# Altium schematic sheet P1.schdoc
size 309 x 223 mm; Symbol: Sheet-Symbol_A5; Device: Sheet-Symbol_A5; @Page Name: P1; @Create Date: 2023-09-04; @Page Count: 1; @Page No: 1; @Project Name: USB2.0 Hub（未验证）; @Schematic Name: Schematic1; @Update Date: 2023-09-15; Company: 深圳嘉立创科技发展有限公司; Drawed: Camellia-ya; Page Size: A5; Part Number: JLCPCB-001; Reviewed: Camellia-ya; Version: V0.1
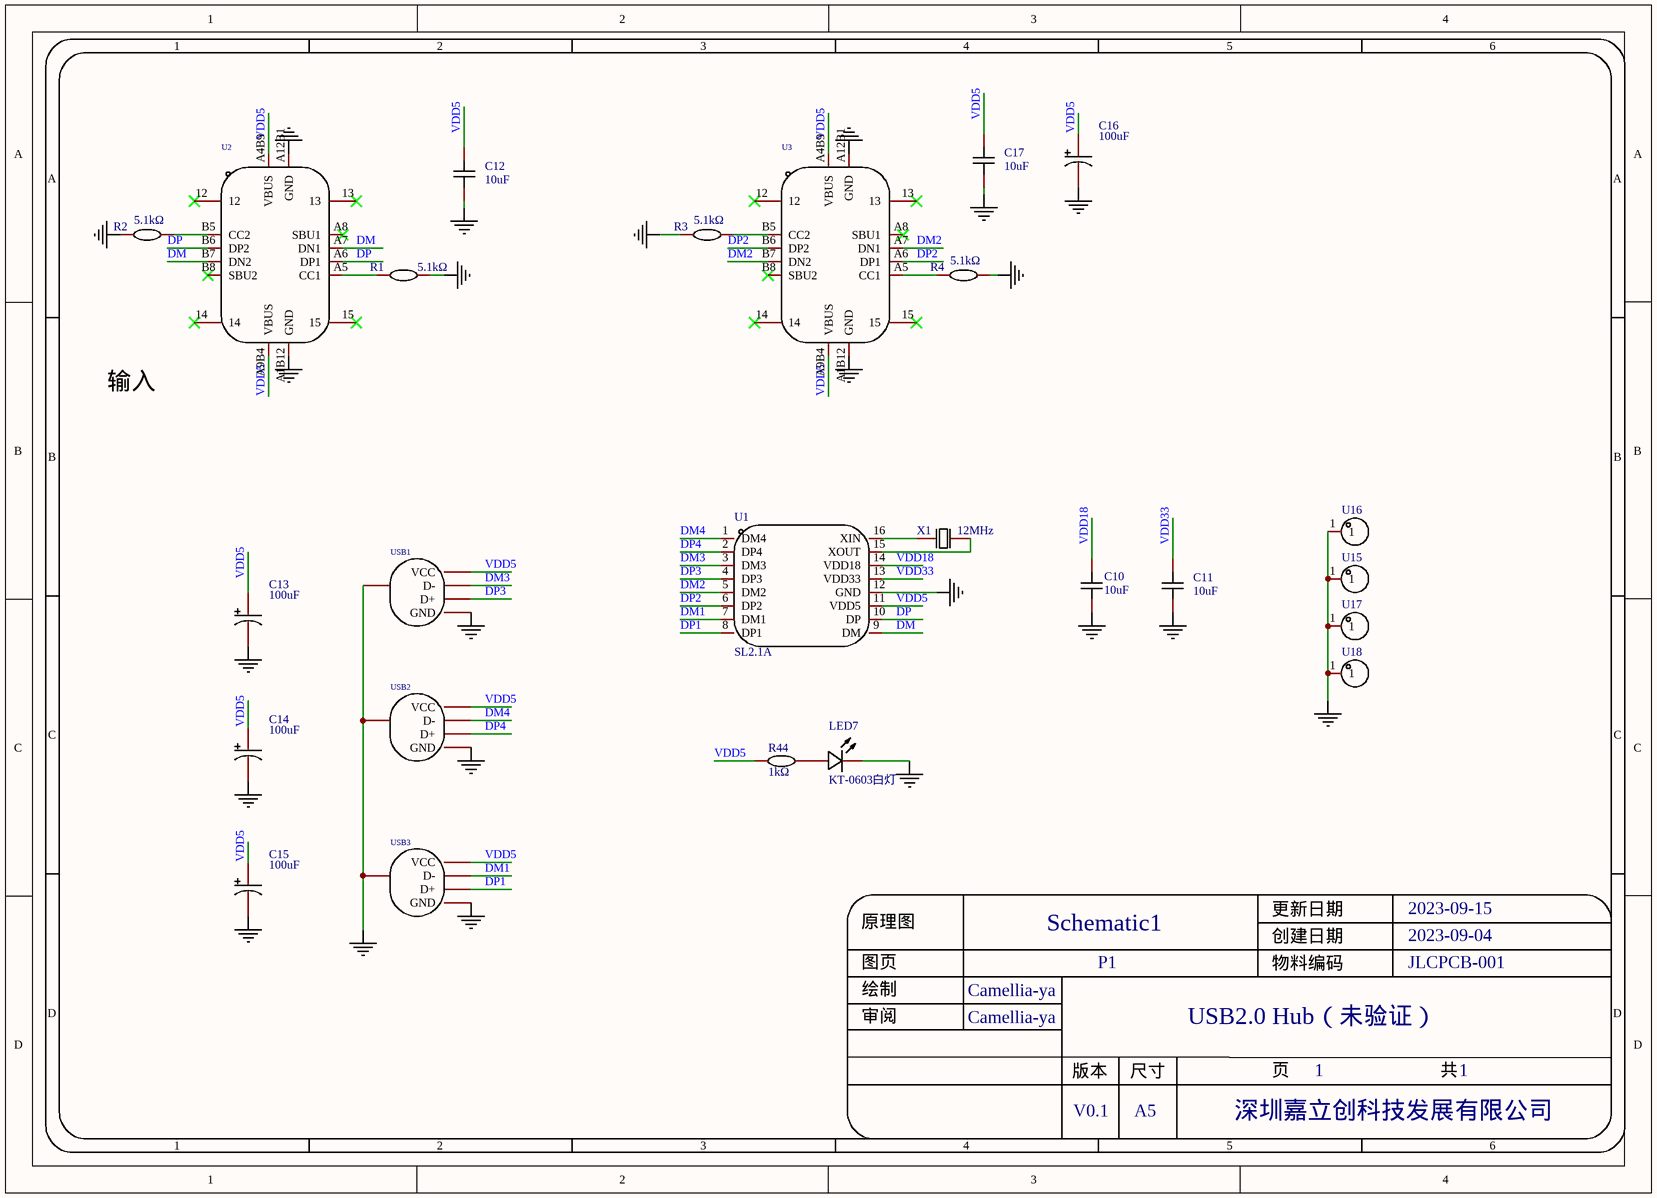
[diagram p0: P1.schdoc]

## Parts
C10  10uF  [C0603]
C11  10uF  [C0603]
C12  10uF  [C0603]
C13  100uF  [CAP-SMD_BD8.0-L8.3-W8.3-LS9.0-FD]
C14  100uF  [CAP-SMD_BD8.0-L8.3-W8.3-LS9.0-FD]
C15  100uF  [CAP-SMD_BD8.0-L8.3-W8.3-LS9.0-FD]
C16  100uF  [CAP-SMD_BD8.0-L8.3-W8.3-LS9.0-FD]
C17  10uF  [C0603]
LED7  KT-0603白灯  [LED0603-R-RD_WHITE]
R1  5.1kΩ  [R0603]
R2  5.1kΩ  [R0603]
R3  5.1kΩ  [R0603]
R4  5.1kΩ  [R0603]
R44  1kΩ  [R0603]
U1  SL2.1A  [SOP-16_L10.0-W3.9-P1.27-LS6.0-BL]
U2  YTC-TC16-273A1  [TYPE-C-SMD_YIYUAN_YTC-TC16-273A1]  (value not drawn)
U3  YTC-TC16-273A1  [TYPE-C-SMD_YIYUAN_YTC-TC16-273A1]  (value not drawn)
U15  铜柱M3*12+3  [TH_BD4.7-D3.0]  (value not drawn)
U16  铜柱M3*12+3  [TH_BD4.7-D3.0]  (value not drawn)
U17  铜柱M3*12+3  [TH_BD4.7-D3.0]  (value not drawn)
U18  铜柱M3*12+3  [TH_BD4.7-D3.0]  (value not drawn)
USB1  AF 90° WJDG  [USB-A-TH_AF-WJDG]  (value not drawn)
USB2  AF 90° WJDG  [USB-A-TH_AF-WJDG]  (value not drawn)
USB3  AF 90° WJDG  [USB-A-TH_AF-WJDG]  (value not drawn)
X1  12MHz  [HC-49US_L11.5-W4.5-P4.88]

## Nets
NetC10_1: C10.1 C11.2 C12.2 C13.2 C14.2 C15.2 C16.2 C17.2 LED7.2(K) R1.1 R2.2 R3.2 R4.1 U1.12(GND) U2.A1B12(GND) U2.A12B1(GND) U3.A1B12(GND) U3.A12B1(GND) U15.1 U16.1 U17.1 U18.1 USB1.4(GND) USB1.5(SHLD) USB2.4(GND) USB2.5(SHLD) USB3.4(GND) USB3.5(SHLD)
DM: U1.9(DM) U2.A7(DN1) U2.B7(DN2)
DM1: U1.7(DM1) USB3.2(D-)
DM2: U1.5(DM2) U3.A7(DN1) U3.B7(DN2)
DM3: U1.3(DM3) USB1.2(D-)
DM4: U1.1(DM4) USB2.2(D-)
DP: U1.10(DP) U2.A6(DP1) U2.B6(DP2)
DP1: U1.8(DP1) USB3.3(D+)
DP2: U1.6(DP2) U3.A6(DP1) U3.B6(DP2)
DP3: U1.4(DP3) USB1.3(D+)
DP4: U1.2(DP4) USB2.3(D+)
VDD5: C12.1 C13.1 C14.1 C15.1 C16.1 C17.1 R44.2 U1.11(VDD5) U2.A4B9(VBUS) U2.A9B4(VBUS) U3.A4B9(VBUS) U3.A9B4(VBUS) USB1.1(VCC) USB2.1(VCC) USB3.1(VCC)
VDD18: C10.2 U1.14(VDD18)
VDD33: C11.1 U1.13(VDD33)
NetLED7_1: LED7.1(A) R44.1
NetR1_2: R1.2 U2.A5(CC1)
NetR2_1: R2.1 U2.B5(CC2)
NetR3_1: R3.1 U3.B5(CC2)
NetR4_2: R4.2 U3.A5(CC1)
NetU1_15: U1.15(XOUT) X1.2(OSC2)
NetU1_16: U1.16(XIN) X1.1(OSC1)

Not connected (* = marked no-connect by the designer): U2 12* 13* 14* 15* A8(SBU1)* B8(SBU2)*; U3 12* 13* 14* 15* A8(SBU1)* B8(SBU2)*

## Notes on the sheet
- 输入
- 1
- 2
- 3
- 4
- 5
- 6
- A
- B
- C
- 原理图
- Schematic1
- 创建日期
- 更新日期
- 2023-09-04
- 2023-09-15
- D
- 审阅
- 绘制
- 图页
- Camellia-ya
- P1
- 物料编码
- USB2.0 Hub（未验证）
- JLCPCB-001
- 版本
- 尺寸
- 页
- 共
- V0.1
- A5
- 深圳嘉立创科技发展有限公司

## Library data of the parts
C10-C12 C17 = CL10A106MA8NRNC: 容值:10uF;精度:±20%;额定电压:25V;材质(温度系数):X5R;; Manufacturer: SAMSUNG(三星); Add into BOM: yes; Tolerance: ±20%; Voltage Rated: 25V; Temperature Coefficient: X5R; Name: 10uF; Symbol: CL10A106MA8NRNC; Device: CL10A106MA8NRNC; LCSC Part Name: 10uF ±20% 25V; Supplier Part: C96446; Manufacturer Part: CL10A106MA8NRNC; Supplier Footprint: 0603; JLCPCB Part Class: 基础库; Datasheet: https://atta.szlcsc.com/upload/public/pdf/source/20170325/1490427913016.pdf; Supplier: LCSC; Convert to PCB: yes; Value: 10uF
C13-C16 = VZH101M1ETR-0806: 容值:100uF;精度:±20%;额定电压:25V;纹波电流:-;等效串联电阻:-;; Manufacturer: lelon(立隆); Symbol: VZH101M1E0806-TRO; Add into BOM: yes; Tolerance: ±20%; Rated Voltage: 25V; φD: 8mm; L: 6.5mm; Lifetime @ Temp: 5000hrs@105℃; Name: 100uF; Device: VZH101M1ETR-0806; LCSC Part Name: 100uF ±20% 25V; Supplier Part: C249834; Manufacturer Part: VZH101M1ETR-0806; Supplier Footprint: SMD,D8xL6.5mm; JLCPCB Part Class: 扩展库; Datasheet: https://atta.szlcsc.com/upload/public/pdf/source/20181114/C249834_B81E92EBF737ED9019D9F6C5277923E5.pdf; Supplier: LCSC; Convert to PCB: yes; Value: 100uF; Ripple Current: -; Equivalent Series Resistance(ESR): -; Operating Temperature: -45℃~+105℃
LED7 = KT-0603白灯: 发光颜色:白灯;; Manufacturer: KENTO; Symbol: 0603White light_C2290; Add into BOM: yes; Emitted Color: 白灯; Name: KT-0603白灯; Device: KT-0603白灯; LCSC Part Name: 白灯; Supplier Part: C2290; Manufacturer Part: KT-0603白灯; Supplier Footprint: 0603; JLCPCB Part Class: 基础库; Datasheet: https://atta.szlcsc.com/upload/public/pdf/source/20221101/4C23D5C85BA051E44A00B833D0A41468.pdf; Supplier: LCSC; Convert to PCB: yes
R1-R4 = 0603WAF5101T5E: 电阻类型:厚膜电阻;阻值:5.1kΩ;精度:±1%;功率:100mW;温度系数:±100ppm/℃;最大工作电压:75V;工作温度范围:-55℃~+155℃;; Manufacturer: UNI-ROYAL(厚声); Add into BOM: yes; Tolerance: ±1%; Power(Watts): 100mW; Overload Voltage (Max): 75V; Name: 5.1kΩ; Symbol: 0603WAF5101T5E; Device: 0603WAF5101T5E; LCSC Part Name: 5.1kΩ ±1% 100mW; Supplier Part: C23186; Manufacturer Part: 0603WAF5101T5E; Supplier Footprint: 0603; JLCPCB Part Class: 基础库; Datasheet: https://atta.szlcsc.com/upload/public/pdf/source/20200306/C422600_1E6D84923E4A46A82E41ADD87F860B5C.pdf; Supplier: LCSC; Convert to PCB: yes; Type: 厚膜电阻; Value: 5.1kΩ; Temperature Coefficient: ±100ppm/℃; Operating Temperature Range: -55℃~+155℃
R44 = 0603WAF1001T5E: 电阻类型:厚膜电阻;阻值:1kΩ;精度:±1%;功率:100mW;; Manufacturer: UNI-ROYAL(厚声); Add into BOM: yes; Tolerance: ±1%; Power(Watts): 100mW; Temperature Coefficient: ±100ppm/℃; Overload Voltage (Max): 75V; Name: 1kΩ; Symbol: 0603WAF1001T5E; Device: 0603WAF1001T5E; LCSC Part Name: 1kΩ ±1% 100mW; Supplier Part: C21190; Manufacturer Part: 0603WAF1001T5E; Supplier Footprint: 0603; JLCPCB Part Class: 基础库; Datasheet: https://atta.szlcsc.com/upload/public/pdf/source/20200306/C422600_1E6D84923E4A46A82E41ADD87F860B5C.pdf; Supplier: LCSC; Convert to PCB: yes; Type: 厚膜电阻; Value: 1kΩ; Operating Temperature Range: -55℃~+155℃
U1 = SL2.1A: 应用功能:集线器;接口协议:-;; Manufacturer: CoreChips(和芯润德); Add into BOM: yes; Applications Function: 集线器; Name: SL2.1A; Symbol: SL2.1A; Device: SL2.1A; LCSC Part Name: SL2.1A USB2.0 HUB 控制器集成电路; Supplier Part: C192893; Manufacturer Part: SL2.1A; Supplier Footprint: SOP-16; JLCPCB Part Class: 扩展库; Datasheet: https://atta.szlcsc.com/upload/public/pdf/source/20180522/C192893_624110D24898D57AAC785E3DF98EA862.pdf; Supplier: LCSC; Convert to PCB: yes; Protocol: -
U2 U3 = YTC-TC16-273A1: 连接器类型:Type-C;公母:母座;触点数量:16;; Manufacturer: YIYUAN(怡远); Add into BOM: yes; Connector Type: Type-C; Gender: 母座; Number of Contacts: 16; NUMBER: A12B1; Name: YTC-TC16-273A1; Symbol: YTC-TC16-273A1; Device: YTC-TC16-273A1; LCSC Part Name: Type-C 母座 16 板上 SMT L=7.3 全贴; Supplier Part: C5260486; Manufacturer Part: YTC-TC16-273A1; Supplier Footprint: SMD; JLCPCB Part Class: 扩展库; Datasheet: https://atta.szlcsc.com/upload/public/pdf/source/20221115/1C643958E5C7CDCF6F0D7C93477BAFEB.pdf; Supplier: LCSC; Convert to PCB: yes; link: https://atta.szlcsc.com/upload/public/pdf/source/20221115/1C643958E5C7CDCF6F0D7C93477BAFEB.pdf
U15-U18 = 铜柱M3*12+3: Manufacturer: 国产; Add into BOM: yes; Name: 铜柱M3*12+3; Symbol: 铜柱M3*12+3; Device: 铜柱M3*12+3; LCSC Part Name: 铜柱M3*12+3 不环保; Supplier Part: C110574; Manufacturer Part: 铜柱M3*12+3; Supplier Footprint: -; JLCPCB Part Class: 扩展库; Datasheet: https://atta.szlcsc.com/upload/public/pdf/source/20180629/C110574_2856CC14D9E3E7E7305ABAA766172BFE.pdf; Supplier: LCSC; Convert to PCB: yes
USB1-USB3 = AF 90° WJDG: 连接器类型:Type-A;标准:USB 2.0;公母:母座;触点数量:4;端口数量:1;安装方式:弯插;额定电流 - 电源:1.5A;工作温度范围:-25℃~+85℃;; Manufacturer: SHOU HAN(首韩); Add into BOM: yes; Connector Type: Type-A; Gender: 母座; Number of Contacts: 4; Number of Ports: 1; Current Rating - Power (Max): 1.5A; Name: AF 90° WJDG; Symbol: AF 90° WJDG; Device: AF 90° WJDG; LCSC Part Name: Type-A 母座 弯插 白胶 卷口有后盖; Supplier Part: C456018; Manufacturer Part: AF 90° WJDG; Supplier Footprint: 插件; JLCPCB Part Class: 扩展库; Supplier: LCSC; Convert to PCB: yes; Standard: USB 2.0; Mounting Style: 弯插; Operating Temperature Range: -25℃~+85℃
X1 = X49SD12MSD2SI: 频率:12MHz;频率公差:±20ppm;负载电容:20pF;; Manufacturer: YXC(扬兴晶振); Add into BOM: yes; Crystal Type: 49S晶振; Frequency Tolerance: ±20ppm; Frequency Stability: ±30ppm; Load Capacitance: 20pF; Name: 12MHz; Symbol: X49SD12MSD2SI; Device: X49SD12MSD2SI; LCSC Part Name: 12MHz ±20ppm 20pF HC-49US; Supplier Part: C114441; Manufacturer Part: X49SD12MSD2SI; Supplier Footprint: HC-49S; JLCPCB Part Class: 扩展库; Datasheet: https://atta.szlcsc.com/upload/public/pdf/source/20210903/A997D130AE99CBB55D9024F9BE6DA174.pdf; Supplier: LCSC; Convert to PCB: yes; Value: 12MHz; Operating Temperature: -40℃~+85℃